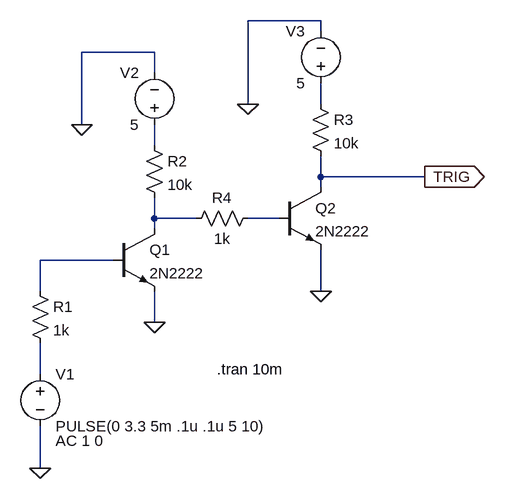
[diagram p0: schematic TRIG.asc]
TRIG.asc, the LTspice schematic file:
Version 4
SHEET 1 880 680
WIRE 464 -208 352 -208
WIRE 464 -192 464 -208
WIRE 208 -160 96 -160
WIRE 208 -128 208 -160
WIRE 352 -80 352 -208
WIRE 464 -80 464 -112
WIRE 96 -48 96 -160
WIRE 208 -16 208 -48
WIRE 464 32 464 0
WIRE 624 32 464 32
WIRE 464 48 464 32
WIRE 208 96 208 64
WIRE 272 96 208 96
WIRE 400 96 352 96
WIRE 208 112 208 96
WIRE 144 160 32 160
WIRE 32 208 32 160
WIRE 464 208 464 144
WIRE 208 256 208 208
WIRE 32 336 32 288
WIRE 32 480 32 416
FLAG 32 480 0
FLAG 208 256 0
FLAG 96 -48 0
FLAG 464 208 0
FLAG 352 -80 0
FLAG 624 32 TRIG
IOPIN 624 32 Out
SYMBOL voltage 32 320 R0
WINDOW 123 24 118 Left 2
SYMATTR Value2 AC 1 0
SYMATTR InstName V1
SYMATTR Value PULSE(0 3.3 5m .1u .1u 5 10)
SYMBOL npn 144 112 R0
SYMATTR InstName Q1
SYMATTR Value 2N2222
SYMBOL Res 16 192 R0
SYMATTR InstName R1
SYMATTR Value 1k
SYMBOL npn 400 48 R0
SYMATTR InstName Q2
SYMATTR Value 2N2222
SYMBOL Voltage 208 -32 R180
WINDOW 0 24 96 Left 2
WINDOW 3 24 16 Left 2
SYMATTR InstName V2
SYMATTR Value 5
SYMBOL Res 192 -32 R0
SYMATTR InstName R2
SYMATTR Value 10k
SYMBOL Res 448 -96 R0
SYMATTR InstName R3
SYMATTR Value 10k
SYMBOL Voltage 464 -96 R180
WINDOW 0 24 96 Left 2
WINDOW 3 24 16 Left 2
SYMATTR InstName V3
SYMATTR Value 5
SYMBOL Res 368 80 R90
WINDOW 0 0 56 VBottom 2
WINDOW 3 32 56 VTop 2
SYMATTR InstName R4
SYMATTR Value 1k
TEXT 304 328 Left 2 !.tran 10m

The netlist it stands for:
* TRIG.asc
V1 N006 0 PULSE(0 3.3 5m .1u .1u 5 10) AC 1 0
Q1 N003 N005 0 0 2N2222
R1 N005 N006 1k
Q2 TRIG N004 0 0 2N2222
V2 N002 0 5
R2 N002 N003 10k
R3 N001 TRIG 10k
V3 N001 0 5
R4 N004 N003 1k
.model NPN NPN
.model PNP PNP
.lib standard.bjt
.tran 10m
.backanno
.end